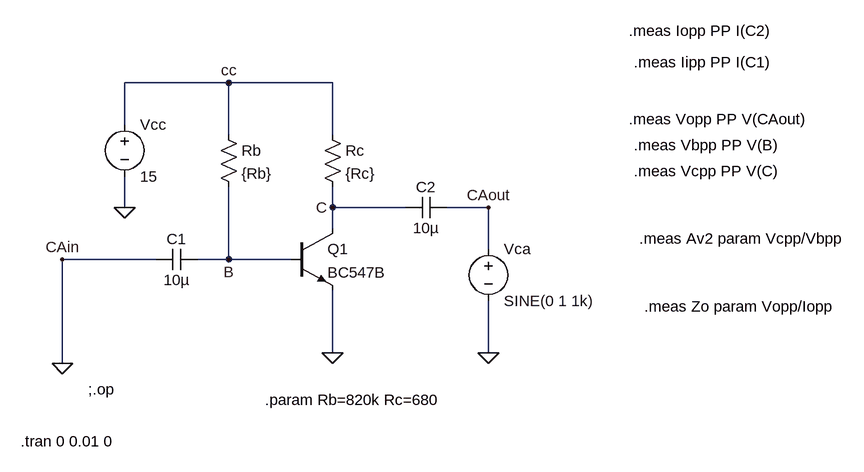
[diagram p0: schematic TBJ01CA_Z0.asc]
TBJ01CA_Z0.asc, the LTspice schematic file:
Version 4
SHEET 1 1608 680
WIRE 128 -16 -32 -16
WIRE 288 -16 128 -16
WIRE -32 48 -32 -16
WIRE 128 64 128 -16
WIRE 288 64 288 -16
WIRE -32 176 -32 128
WIRE 288 176 288 144
WIRE 400 176 288 176
WIRE 528 176 464 176
WIRE 288 208 288 176
WIRE 528 240 528 176
WIRE 16 256 -128 256
WIRE 128 256 128 144
WIRE 128 256 80 256
WIRE 224 256 128 256
WIRE 288 400 288 304
WIRE 528 400 528 320
WIRE -128 416 -128 256
FLAG -32 176 0
FLAG 288 400 0
FLAG -128 416 0
FLAG 128 -16 cc
FLAG -128 256 CAin
FLAG 528 400 0
FLAG 528 176 CAout
FLAG 128 256 B
FLAG 288 176 C
SYMBOL res 112 48 R0
SYMATTR InstName Rb
SYMATTR Value {Rb}
SYMBOL res 272 48 R0
SYMATTR InstName Rc
SYMATTR Value {Rc}
SYMBOL voltage -32 32 R0
WINDOW 123 0 0 Left 0
WINDOW 39 0 0 Left 0
SYMATTR InstName Vcc
SYMATTR Value 15
SYMBOL npn 224 208 R0
SYMATTR InstName Q1
SYMATTR Value BC547B
SYMBOL cap 80 240 R90
WINDOW 0 0 32 VBottom 2
WINDOW 3 32 32 VTop 2
SYMATTR InstName C1
SYMATTR Value 10µ
SYMBOL cap 464 160 R90
WINDOW 0 0 32 VBottom 2
WINDOW 3 32 32 VTop 2
SYMATTR InstName C2
SYMATTR Value 10µ
SYMBOL voltage 528 224 R0
WINDOW 123 0 0 Left 0
WINDOW 39 0 0 Left 0
SYMATTR InstName Vca
SYMATTR Value SINE(0 1 1k)
TEXT -192 536 Left 2 !.tran 0 0.01 0
TEXT -88 456 Left 2 !;.op
TEXT 744 40 Left 2 !.meas Vopp PP V(CAout)
TEXT 752 80 Left 2 !.meas Vbpp PP V(B)
TEXT 752 120 Left 2 !.meas Vcpp PP V(C)
TEXT 760 224 Left 2 !.meas Av2 param Vcpp/Vbpp
TEXT 752 -48 Left 2 !.meas Iipp PP I(C1)
TEXT 744 -96 Left 2 !.meas Iopp PP I(C2)
TEXT 768 328 Left 2 !.meas Zo param Vopp/Iopp
TEXT 184 472 Left 2 !.param Rb=820k Rc=680

The netlist it stands for:
* TBJ01CA_Z0.asc
Rb cc B {Rb}
Rc cc C {Rc}
Vcc cc 0 15
Q1 C B 0 0 BC547B
C1 B 0 10µ
C2 CAout C 10µ
Vca CAout 0 SINE(0 1 1k)
.model NPN NPN
.model PNP PNP
.lib standard.bjt
.tran 0 0.01 0
;.op
.meas Vopp PP V(CAout)
.meas Vbpp PP V(B)
.meas Vcpp PP V(C)
.meas Av2 param Vcpp/Vbpp
.meas Iipp PP I(C1)
.meas Iopp PP I(C2)
.meas Zo param Vopp/Iopp
.param Rb=820k Rc=680
.backanno
.end